# EAGLE design CCD (EAGLE 6.6.0)
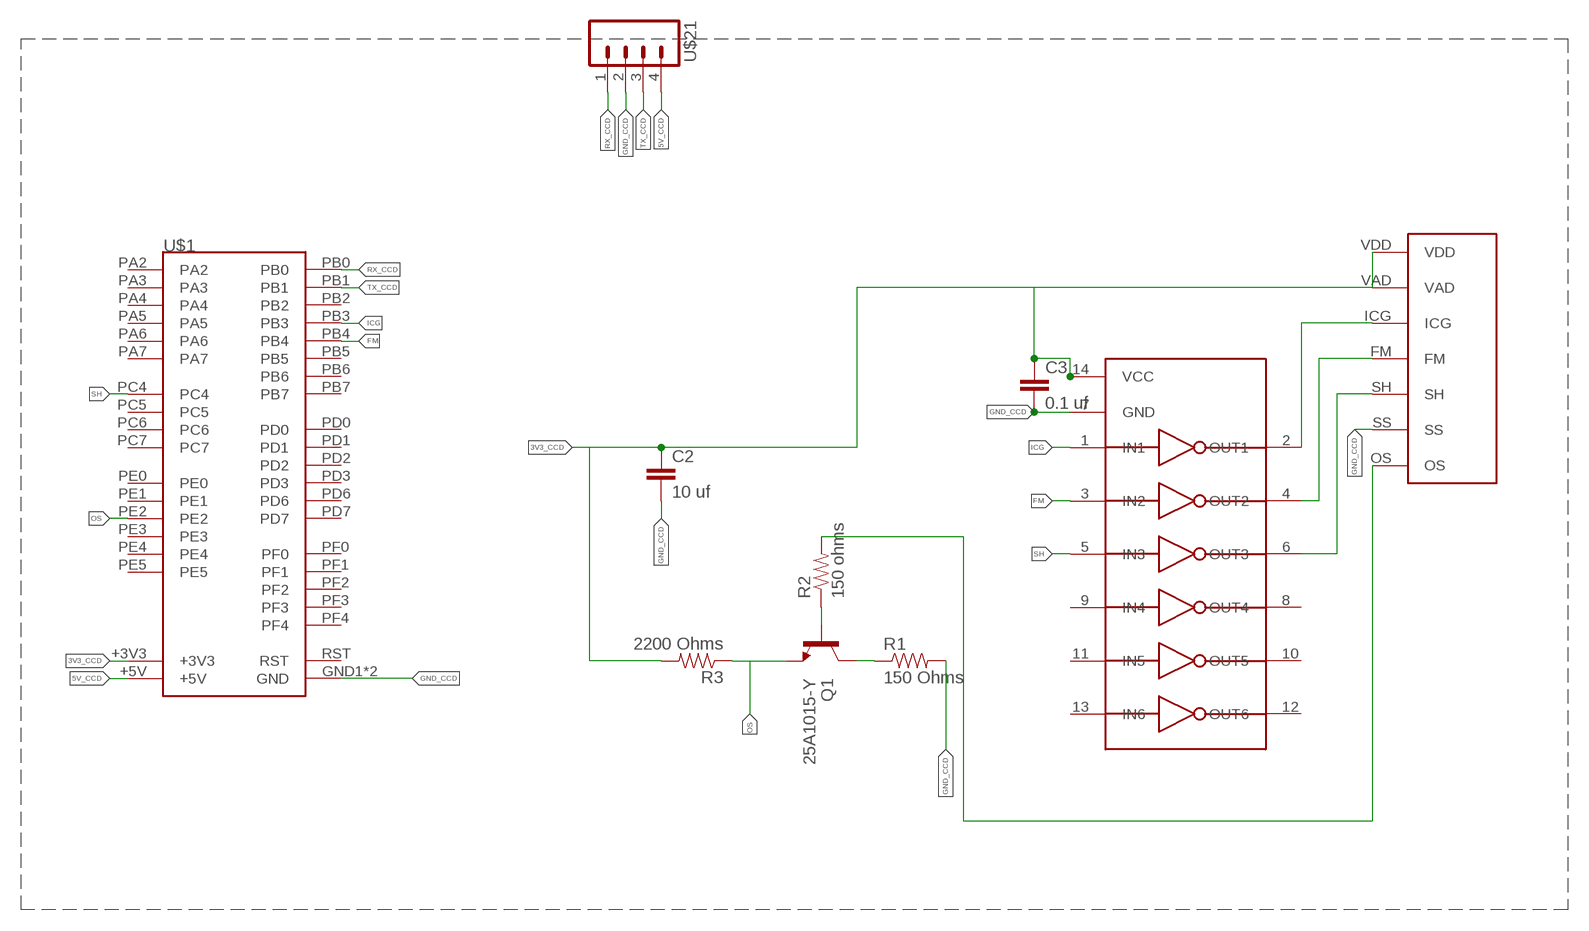
[diagram p0: schematic, sheet 1]

## Parts
C2  10 uf  CAP0603-CAP  [0603-CAP]
C3  0.1 uf  CAP0603-CAP  [0603-CAP]
Q1  25A1015-Y  TRANSISTOR_NPNBC547  [TO-92-AMMO]
R1  150 Ohms  RESISTOR0603-RES  [0603-RES]
R2  150 ohms  RESISTOR0603-RES  [0603-RES]
R3  2200 Ohms  RESISTOR0603-RES  [0603-RES]
U$1  TIVA-C  [TIVA-C]
U$11  TC74HC04AP  [DIP14]
U$12  TCD1304DG  [CCD_PACKAGE]
U$21  M04  [MOLEX_0436500400]

## Nets
3V3_CCD: C2.1 C3.1 R3.2 U$1.+3V3 U$11.14(VCC) U$12.VAD U$12.VDD
5V_CCD: U$1.+5V U$21.4
FM: U$1.PB4 U$11.3(IN2)
GND_CCD: C2.2 C3.2 R1.2 U$1.GND1(GND) U$1.GND2(GND) U$11.7(GND) U$12.SS U$21.2
ICG: U$1.PB3 U$11.1(IN1)
N$4: Q1.1(C) R1.1
N$5: Q1.2(B) R2.1
N$9: U$11.2(OUT1) U$12.ICG
N$10: U$11.4(OUT2) U$12.FM
N$11: U$11.6(OUT3) U$12.SH
N$12: R2.2 U$12.OS
OS: Q1.3(E) R3.1 U$1.PE2
RX_CCD: U$1.PB0 U$21.1
SH: U$1.PC4 U$11.5(IN3)
TX_CCD: U$1.PB1 U$21.3
Unconnected: U$1.PA2 U$1.PA3 U$1.PA4 U$1.PA5 U$1.PA6 U$1.PA7 U$1.PB2 U$1.PB5 U$1.PB6 U$1.PB7 U$1.PC5 U$1.PC6 U$1.PC7 U$1.PD0 U$1.PD1 U$1.PD2 U$1.PD3 U$1.PD6 U$1.PD7 U$1.PE0 U$1.PE1 U$1.PE3 U$1.PE4 U$1.PE5 U$1.PF0 U$1.PF1 U$1.PF2 U$1.PF3 U$1.PF4 U$11.8(OUT4) U$11.9(IN4) U$11.10(OUT5) U$11.11(IN5) U$11.12(OUT6) U$11.13(IN6)

## Power pins joined to a net without a drawn wire
RST: U$1.RST

## Library data of the parts
C2 C3 = SparkFun-Passives:CAP: Capacitor Standard 0603 ceramic capacitor, and 0.1" leaded capacitor.
Q1 = SparkFun-DiscreteSemi:TRANSISTOR_NPN: Generic NPN BJT MMBT2222A - TRANS-08049 (SOT-23, 1A 40V) MPSA42 - TRANS-09116 (SOT-23, 500mA 300V) MMBT5088LT1G - TRANS-11160 (SOT-23, 50 mA 30V) BC547 - COM-08928 <http://www.sparkfun.com/products/8928> (TO-92 45V 100mA) (1.Collector 2.Base 3.Emitter) 2N3904 - COM-00521 <http://www.sparkfun.com/products/521> (TO-92 40V 200mA) (1.Emitter 2.Base 3.Collector) P2N2222A - COM-12852 <http://www.sparkfun.com/products/12852> (TO-92 40V 600mA) (1.Collector 2.Base 3.Emitter)
R1-R3 = SparkFun-Passives:RESISTOR: Resistor Basic schematic elements and footprints for 0603, 1206, and PTH resistors.
U$1 = MRDT-2015-General:TIVA-C: TIVA-C DEV BOARD (NON-CONNECTED)
U$11 = MRDT-2015-General:TC74HC04AP
U$12 = MRDT-2015-General:TCD1304DG
U$21 = MRDT-Connectors:M04

## Board
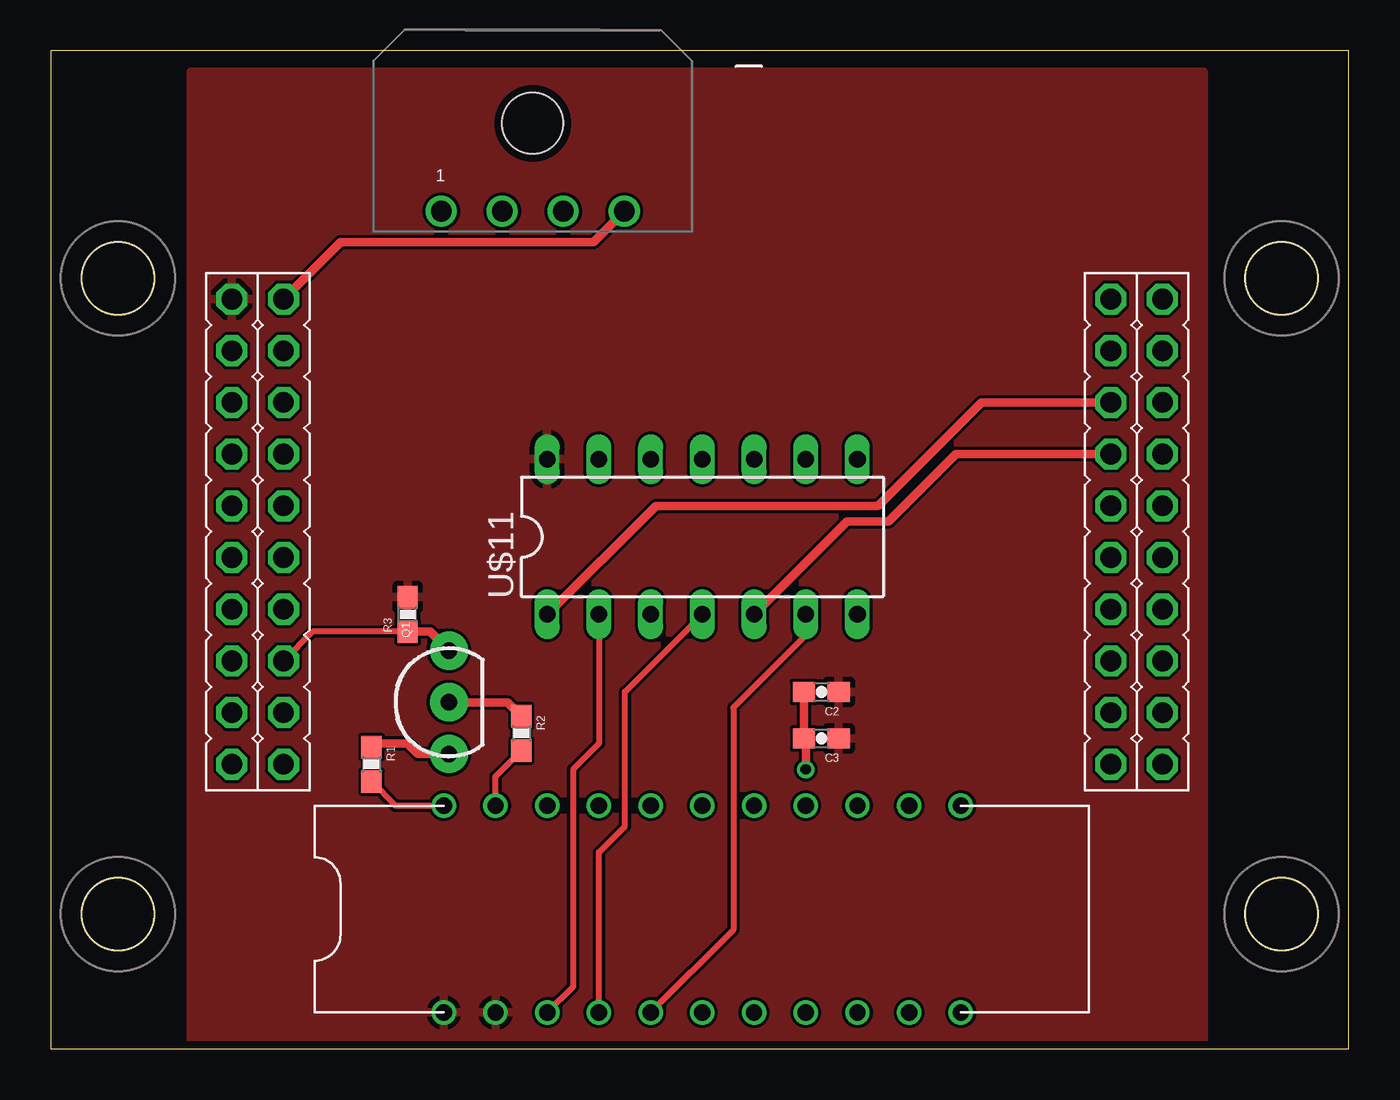
[diagram p1: board, top side]
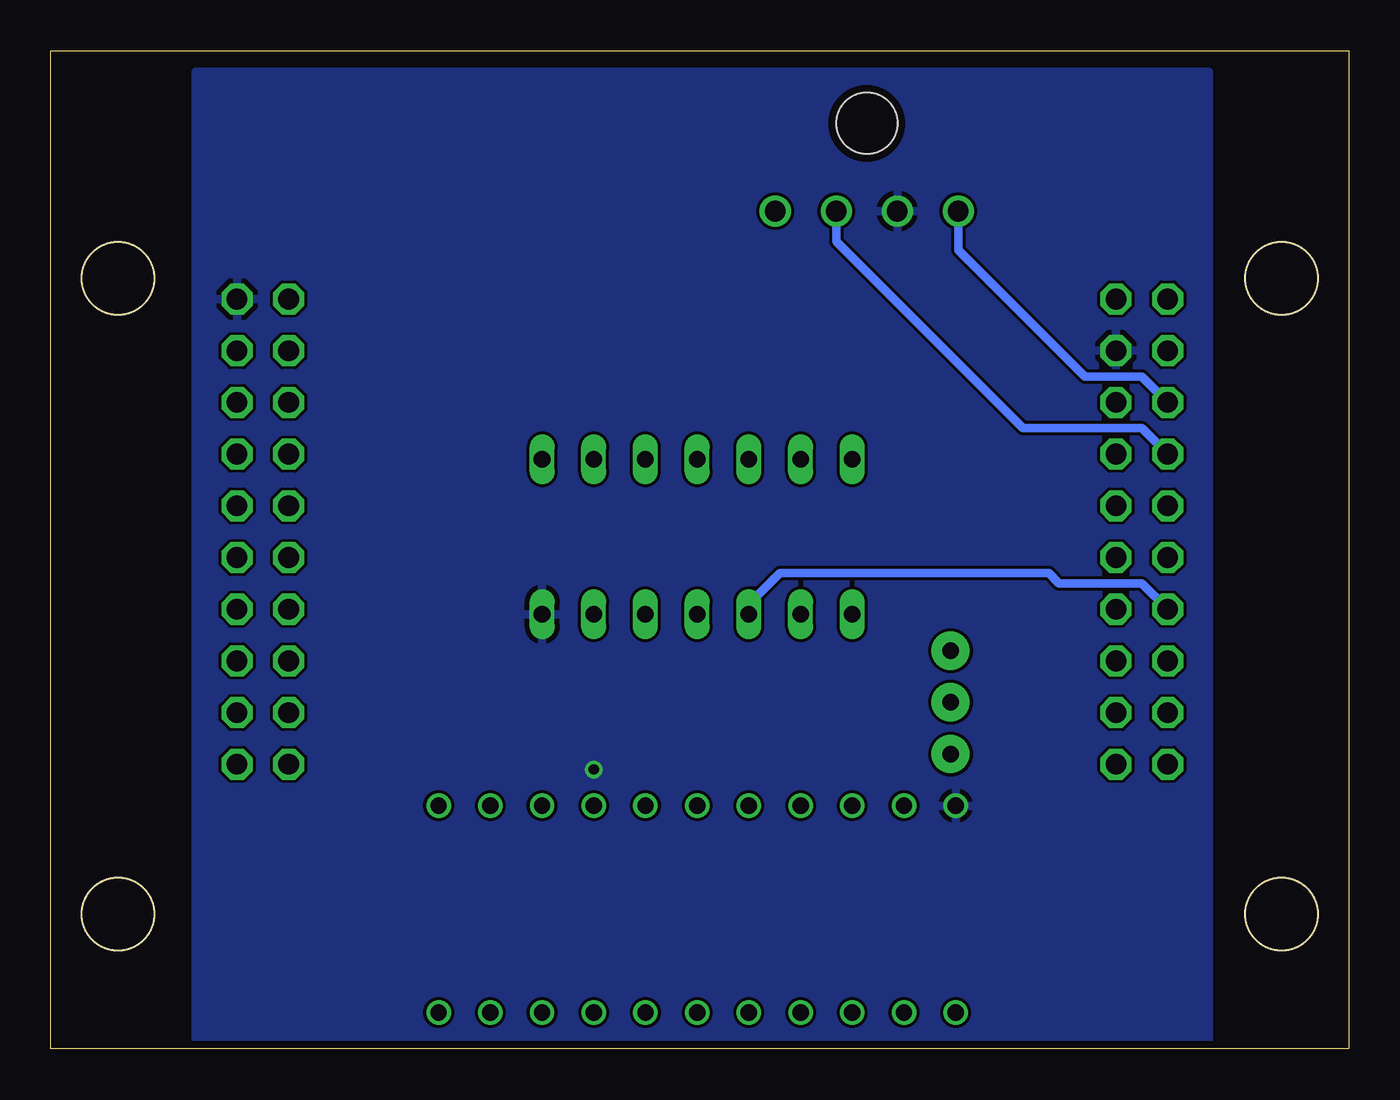
[diagram p2: board, bottom side, seen from below]

Size 63.75 x 49.02 mm. Coordinates in mm from the lower left corner, seen from the top.
Outline: 0,0 63.75,0 63.75,49.02 0,49.02 0,0
Copper layers (1*16): Top 0.0356mm / dielectric 1.5011mm / Bottom 0.0356mm
Design rules "LaenPCBOrder": minimum track width 6mil, minimum drill 13mil, track to track 6mil, track to pad 6mil, pad to pad 6mil, via to via 6mil, smd to smd 6mil, copper to edge 15mil, drill to drill 6mil, minimum pad ring 7mil, minimum via ring 7mil, stop-mask expansion 3mil, vias tented up to drill 0mil, thermal gap 10mil

### Footprints (pad centres in the part's own frame; a part is rotated, then mirrored left to right if it is on the bottom)
0603-CAP = smd 1.1 x 1: 1 -0.85,0; 2 0.85,0
TO-92-AMMO = drill 0.813 pad 1.88: 1 -2.54,0; 2 0,0; 3 2.54,0
0603-RES = smd 1.1 x 1: 1 -0.85,0; 2 0.85,0
TIVA-C = drill 1.016 octagon: +3V3 30.48,2.54; +5V 30.48,5.08; GND1 33.02,5.08; GND2 30.48,48.26; PA2 53.34,48.26; PA3 50.8,48.26; PA4 48.26,48.26; PA5 48.26,2.54; PA6 50.8,2.54; PA7 53.34,2.54; PB0 35.56,2.54; PB1 38.1,2.54; PB2 33.02,48.26; PB3 35.56,45.72; PB4 45.72,2.54; PB5 33.02,2.54; PB6 45.72,48.26; PB7 43.18,48.26; PC4 38.1,45.72; PC5 40.64,45.72; PC6 43.18,45.72; PC7 45.72,45.72; PD0 35.56,5.08; PD1 38.1,5.08; PD2 40.64,5.08; PD3 43.18,5.08; PD6 48.26,45.72; PD7 50.8,45.72; PE0 35.56,48.26; PE1 45.72,5.08; PE2 48.26,5.08; PE3 50.8,5.08; PE4 40.64,2.54; PE5 43.18,2.54; PF0 38.1,48.26; PF1 53.34,5.08; PF2 30.48,45.72; PF3 33.02,45.72; PF4 53.34,45.72; RST 40.64,48.26
DIP14 = drill 0.813 long: 1 -7.62,-3.81; 2 -5.08,-3.81; 3 -2.54,-3.81; 4 0,-3.81; 5 2.54,-3.81; 6 5.08,-3.81; 7 7.62,-3.81; 8 7.62,3.81; 9 5.08,3.81; 10 2.54,3.81; 11 0,3.81; 12 -2.54,3.81; 13 -5.08,3.81; 14 -7.62,3.81
CCD_PACKAGE = drill 0.8: FM -5.08,-3.81; ICG -7.62,-3.81; OS -10.16,6.35; P$6 0,-3.81; P$7 2.54,-3.81; P$8 5.08,-3.81; P$9 7.62,-3.81; P$10 10.16,-3.81; P$11 12.7,-3.81; P$12 12.7,6.35; P$13 10.16,6.35; P$14 7.62,6.35; P$15 5.08,6.35; P$16 2.54,6.35; P$17 0,6.35; P$18 -2.54,6.35; P$19 -5.08,6.35; P$20 -7.62,6.35; SH -2.54,-3.81; SS -12.7,6.35; VAD -10.16,-3.81; VDD -12.7,-3.81
#6_SCREW = hole 3.556: 0,0
MOLEX_0436500400 = drill 1.016: 1 11.049,8.89; 2 8.052,8.89; 3 5.055,8.89; 4 2.057,8.89 | hole 2.997: 6.553,4.572

### Placement (x,y rotation side)
C2  37.85,17.53 180 top
C3  37.85,15.24 180 top
Q1  19.56,17.02 90 top
R1  15.75,13.97 270 top
R2  23.11,15.49 270 top
R3  17.53,21.34 90 top
U$1  6.35,67.31 270 top
U$11  32,25.15 0 top
U$12  32,5.59 0 top
U$13  [#6_SCREW]  60.45,37.85 0 top
U$14  [#6_SCREW]  60.45,6.6 0 top
U$15  [#6_SCREW]  3.3,6.6 0 top
U$16  [#6_SCREW]  3.3,37.85 0 top
U$21  30.23,50.04 180 top

### Tracks (layer width: path | path; a pad name or v marks a point on that pad's centre or on a via)
3V3_CCD
  pour Top: 6.86,48.01 6.86,0.25 56.64,0.25 56.64,48.01
5V_CCD
  Top 0.406: U$21.4 28.17,41.12 26.67,39.62 14.22,39.62 U$1.+5V
FM
  Bottom 0.406: U$11.3 29.46,21.84 27.94,23.37 14.73,23.37 14.22,22.86 10.16,22.86 U$1.PB4
GND_CCD  (via drill 0.5)
  Top 0.305: U$12.SS 16.93,11.94 R1.2
  Top 0.406: C3.2 C2.2 37,15.07 37.08,14.99 v37.08,13.72
  Bottom 0.406: v37.08,13.72 37.08,13.46
  pour Bottom: 6.86,0.25 6.86,48.01 56.64,48.01 56.64,0.25
ICG
  Top 0.406: U$1.PB3 45.72,31.75 40.64,26.67 29.72,26.67 U$11.1
N$4
  Top 0.406: Q1.1 18.03,14.48 17.53,14.99 15.91,14.99 R1.1
N$5
  Top 0.406: Q1.2 22.44,17.02 R2.1
N$9
  Top 0.305: U$11.2 26.92,14.99 25.65,13.72 25.65,3.05 U$12.ICG
N$10
  Top 0.305: U$12.FM 26.92,9.65 28.19,10.92 28.19,17.53 U$11.4
N$11
  Top 0.305: U$11.6 37.08,20.32 33.53,16.76 33.53,5.84 U$12.SH
N$12
  Top 0.305: U$12.OS 21.84,13.37 R2.2
OS
  Top 0.305: R3.1 12.87,20.49 U$1.PE2
  Top 0.406: R3.1 18.63,20.49 Q1.3 | 11.52,18.96 U$1.PE2
RX_CCD
  Bottom 0.406: U$21.1 19.18,39.24 12.95,33.02 10.16,33.02 U$1.PB0
SH
  Top 0.406: U$1.PC4 44.45,29.21 41.15,25.91 39.12,25.91 U$11.5
TX_CCD
  Bottom 0.406: 25.15,41.15 U$21.3 25.17,39.65 16,30.48 10.16,30.48 U$1.PB1